# EAGLE design MotorDriver (EAGLE 9.1.3)

## Sheet 1 of 3: Power&Connection
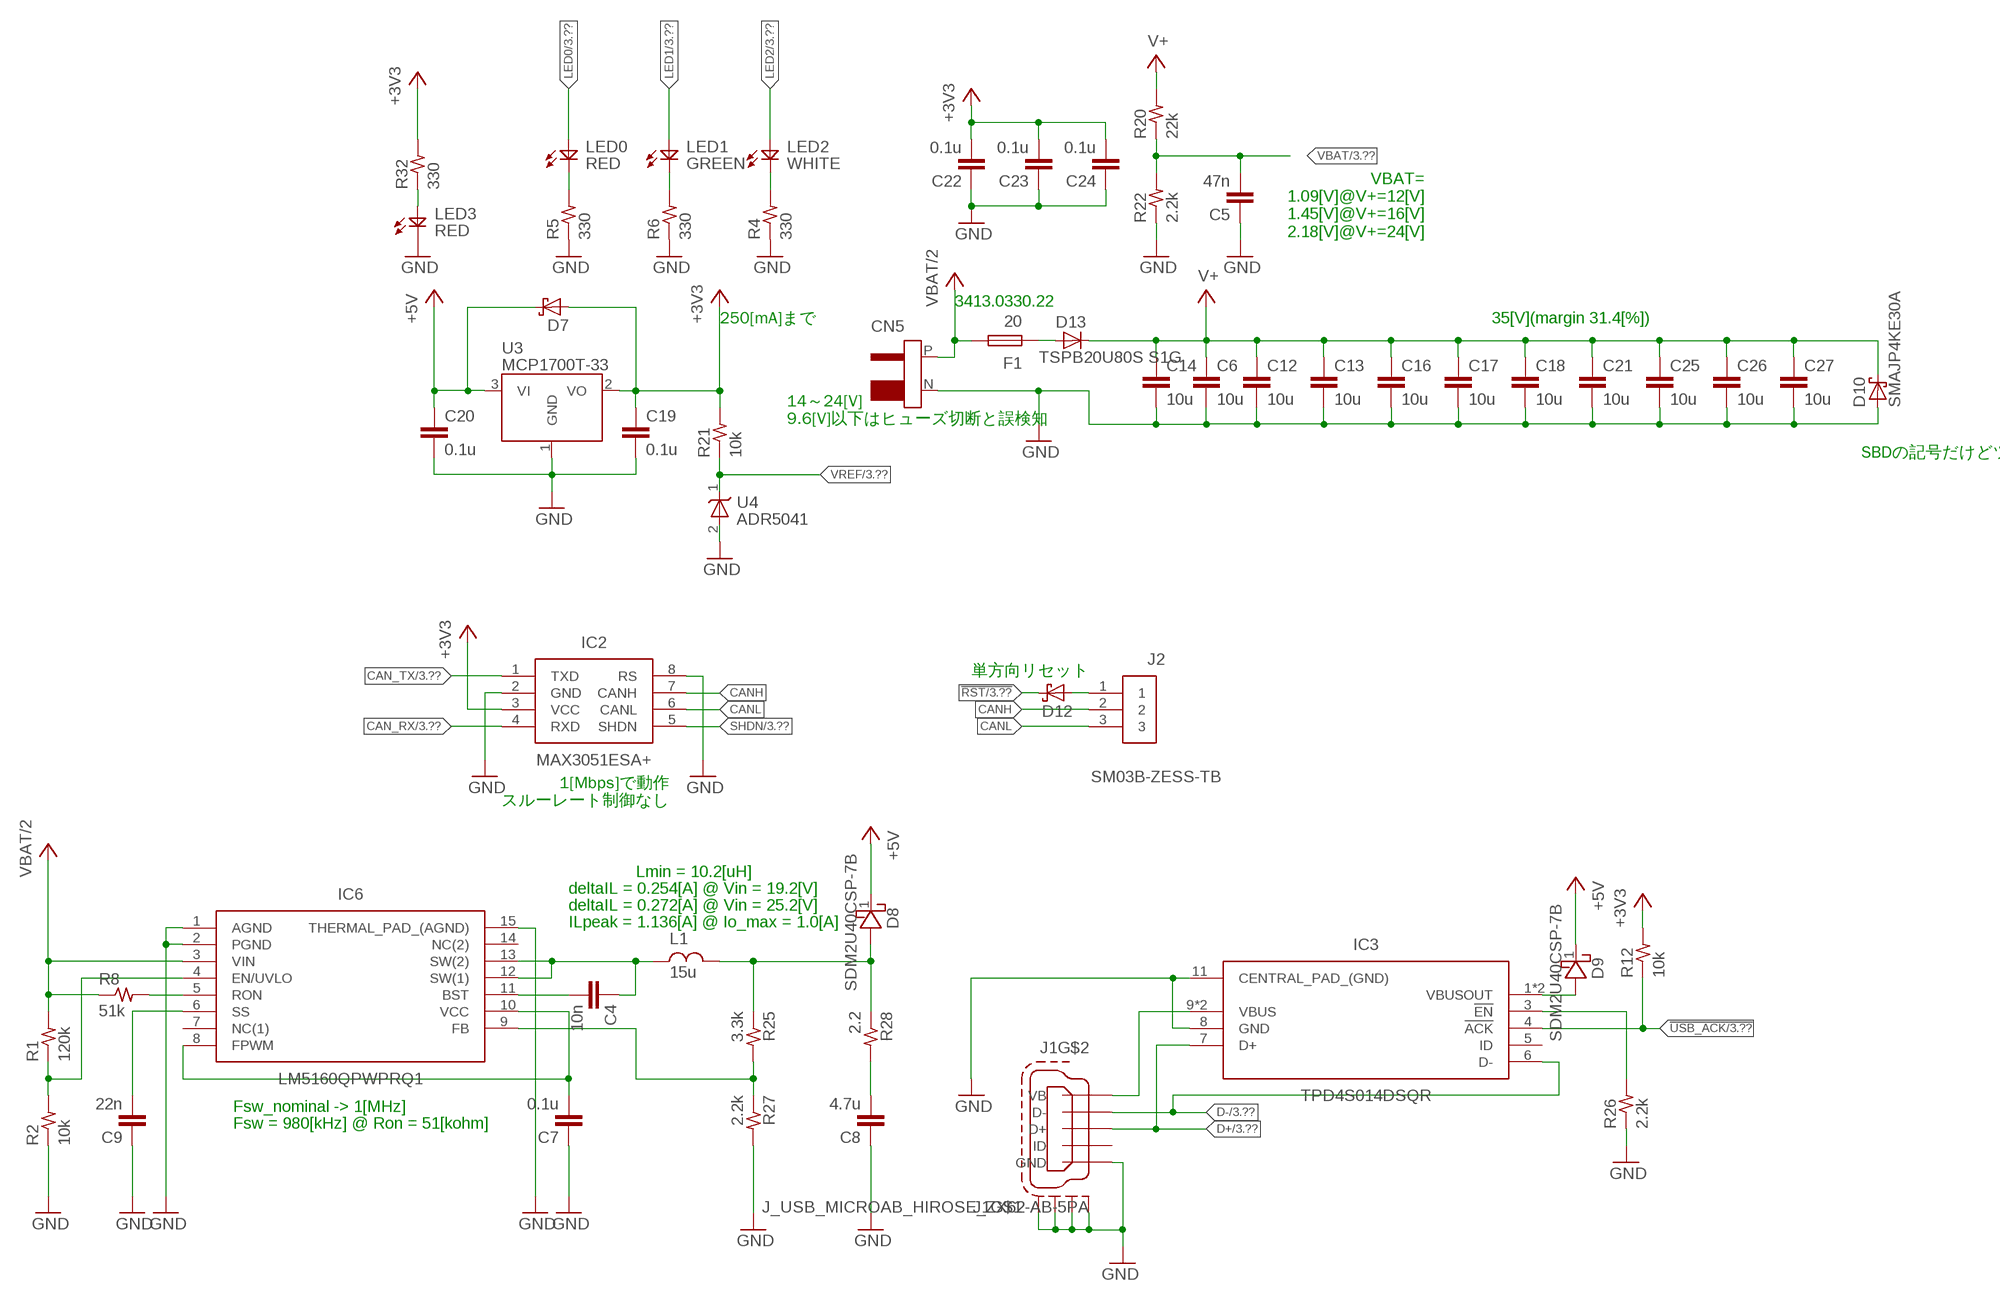
[diagram p0: schematic, sheet 1]

### Parts
C4  10n  C1005  [C1005]
C5  47n  C1005  [C1005]
C6  10u  C3225  [C3225]
C7  0.1u  C1005  [C1005]
C8  4.7u  C1608  [1608]
C9  22n  C1005  [C1005]
C12  10u  C3225  [C3225]
C13  10u  C3225  [C3225]
C14  10u  C3225  [C3225]
C16  10u  C3225  [C3225]
C17  10u  C3225  [C3225]
C18  10u  C3225  [C3225]
C19  0.1u  C1005  [C1005]
C20  0.1u  C1005  [C1005]
C21  10u  C3225  [C3225]
C22  0.1u  C1005  [C1005]
C23  0.1u  C1005  [C1005]
C24  0.1u  C1005  [C1005]
C25  10u  C3225  [C3225]
C26  10u  C3225  [C3225]
C27  10u  C3225  [C3225]
CN5  T-CON  [T-CON]
D7  SBD-SOD523  [DIODE_SOD523]
D8  SDM2U40CSP-7B  [X3-WLB1608-2]
D9  SDM2U40CSP-7B  [X3-WLB1608-2]
D10  SMAJP4KE30A  SBD-DO-214AC  [DO-214AC]
D12  SBD-SOD523  [DIODE_SOD523]
D13  TSPB20U80S S1G  DIODE-SMPC  [SMPC]
F1  20  F3216  [3216]
IC2  MAX3051ESA+  [SOIC127P600X175-8N]
IC3  TPD4S014DSQR  [SON40P200X200X80-11N]
IC6  LM5160QPWPRQ1  [SOP65P640X110-15N]
J1  J_USB_MICROAB_HIROSE_ZX62-AB-5PA  [J_USB_MICROAB_HIROSE_ZX62-AB-5PA]
J2  SM03B-ZESS-TB  [SM03B-ZESS-TB]
L1  15u  L50  [L4949]
LED0  RED  LED1608  [LED1608]
LED1  GREEN  LED1608  [LED1608]
LED2  WHITE  LED1608  [LED1608]
LED3  RED  LED1608  [LED1608]
R1  120k  R1005  [R1005]
R2  10k  R1005  [R1005]
R4  330  R1005  [R1005]
R5  330  R1005  [R1005]
R6  330  R1005  [R1005]
R8  51k  R1005  [R1005]
R12  10k  R1005  [R1005]
R20  22k  R1005  [R1005]
R21  10k  R1005  [R1005]
R22  2.2k  R1005  [R1005]
R25  3.3k  R1005  [R1005]
R26  2.2k  R1005  [R1005]
R27  2.2k  R1005  [R1005]
R28  2.2  R1005  [R1005]
R32  330  R1005  [R1005]
U3  MCP1700T-33  [SOT23-3]
U4  ADR5041  [SC70-3]

### Nets
!RST: D12.K ; also sheet 3
!USB_ACK: IC3.4(!ACK) R12.1 ; also sheet 3
+3V3: C19.1 C22.2 C23.2 C24.2 D7.A IC2.3(VCC) R12.2 R21.2 R32.2 U3.2(VO) ; also sheet 2,3
+5V: C20.1 D7.K D8.1(K) D9.1(K) U3.3(VI) ; also sheet 2
CAN_RX: IC2.4(RXD) ; also sheet 3
CAN_TX: IC2.1(TXD) ; also sheet 3
CANH: IC2.7(CANH) J2.2
CANL: IC2.6(CANL) J2.3
D+: IC3.7(D+) J1.P$3(D+) ; also sheet 3
D-: IC3.6(D-) J1.P$2(D-) ; also sheet 3
GND: C5.1 C6.2 C7.1 C8.1 C9.1 C12.2 C13.2 C14.2 C16.2 C17.2 C18.2 C19.2 C20.2 C21.2 C22.1 C23.1 C24.1 C25.2 C26.2 C27.2 CN5.N D10.A IC2.2(GND) IC2.8(RS) IC3.8(GND) IC3.11(CENTRAL_PAD_(GND)) IC6.1(AGND) IC6.2(PGND) IC6.15(THERMAL_PAD_(AGND)) J1.P$5(GND) J1.SHIELD1(S1) J1.SHIELD2(S2) J1.SHIELD3(S3) J1.SHIELD4(S4) LED3.K R2.1 R4.1 R5.1 R6.1 R22.1 R26.1 R27.2 U3.1(GND) U4.2(A) ; also sheet 2,3
LED0: LED0.A ; also sheet 3
LED1: LED1.A ; also sheet 3
LED2: LED2.A ; also sheet 3
N$1: C7.2 IC6.8(FPWM) IC6.10(VCC)
N$2: IC6.5(RON) R8.2
N$3: IC6.4(EN/UVLO) R1.1 R2.2
N$4: C9.2 IC6.6(SS)
N$8: LED2.K R4.2
N$9: LED0.K R5.2
N$10: LED1.K R6.2
N$14: IC3.9(VBUS) IC3.10(VBUS) J1.P$1(VB)
N$16: C4.1 IC6.12(SW(1)) IC6.13(SW(2)) L1.1
N$17: IC6.9(FB) R25.2 R27.1
N$18: C4.2 IC6.11(BST)
N$19: C8.2 R28.2
N$23: D13.1(A) D13.2(A) F1.1
N$24: D12.A J2.1
N$26: D8.2(A) L1.2 R25.1 R28.1
N$28: IC3.3(!EN) R26.2
N$31: LED3.A R32.1
SHDN: IC2.5(SHDN) ; also sheet 3
V+: C6.1 C12.1 C13.1 C14.1 C16.1 C17.1 C18.1 C21.1 C25.1 C26.1 C27.1 D10.K D13.K R20.2 ; also sheet 2
VBAT: C5.2 R20.1 R22.2 ; also sheet 3
VBAT/2: CN5.P F1.2 IC6.3(VIN) R1.2 R8.1
VBUS: D9.2(A) IC3.1(VBUSOUT) IC3.2(VBUSOUT)
VREF: R21.1 U4.1(K) ; also sheet 3
Unconnected: IC3.5(ID) IC6.7(NC(1)) IC6.14(NC(2)) J1.P$4(ID)

### Notes on the sheet
- VBAT=
    1.09[V]@V+=12[V]
    1.45[V]@V+=16[V]
    2.18[V]@V+=24[V]
- 3413.0330.22
- 250[mA]まで | 35[V](margin 31.4[%])
- 14～24[V]
  9.6[V]以下はヒューズ切断と誤検知
- SBDの記号だけどツェナー
- 単方向リセット
- 1[Mbps]で動作
  スルーレート制御なし
- Lmin = 10.2[uH]
- deltaIL = 0.254[A] @ Vin = 19.2[V]
- deltaIL = 0.272[A] @ Vin = 25.2[V]
- ILpeak = 1.136[A] @ Io_max = 1.0[A]
- Fsw_nominal -> 1[MHz]
- Fsw = 980[kHz] @ Ron = 51[kohm]

## Sheet 2 of 3: Motor
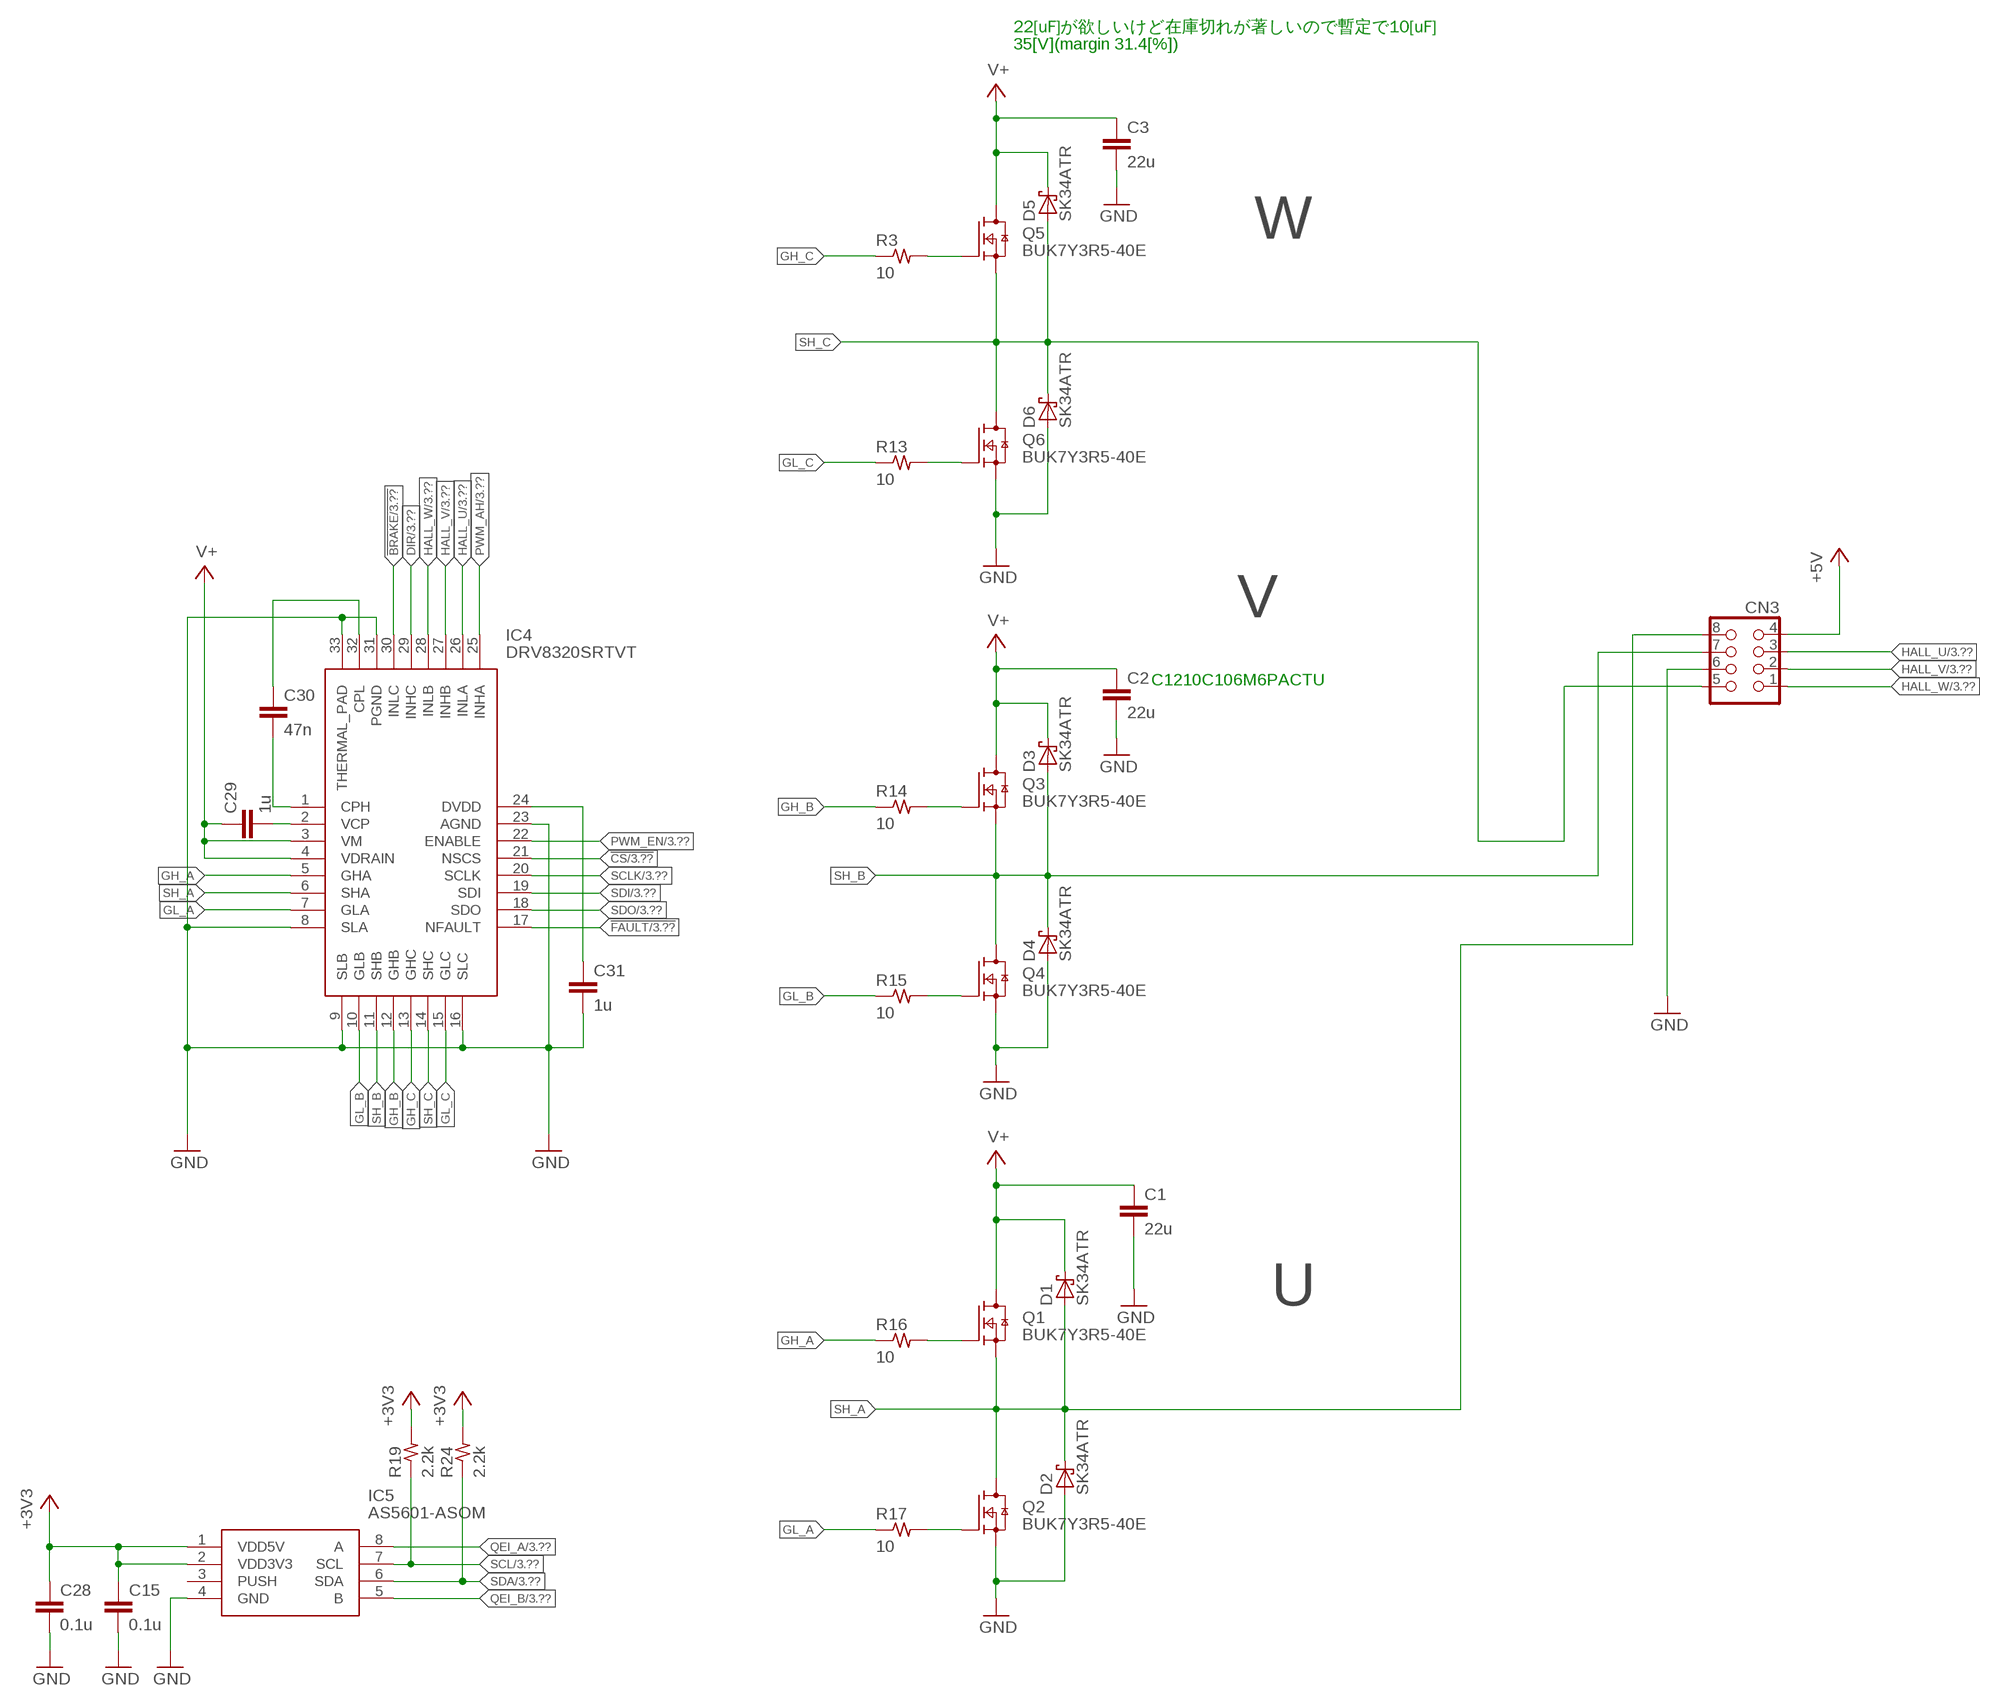
[diagram p1: schematic, sheet 2]

### Parts
C1  22u  C3225  [C3225]
C2  22u  C3225  [C3225]
C3  22u  C3225  [C3225]
C15  0.1u  C1005  [C1005]
C28  0.1u  C1005  [C1005]
C29  1u  C1005  [C1005]
C30  47n  C1005  [C1005]
C31  1u  C1005  [C1005]
CN3  43045-0800  [43045-0800]
D1  SK34ATR  SBD-DO-214AC  [DO-214AC]
D2  SK34ATR  SBD-DO-214AC  [DO-214AC]
D3  SK34ATR  SBD-DO-214AC  [DO-214AC]
D4  SK34ATR  SBD-DO-214AC  [DO-214AC]
D5  SK34ATR  SBD-DO-214AC  [DO-214AC]
D6  SK34ATR  SBD-DO-214AC  [DO-214AC]
IC4  DRV8320SRTVT  [QFN50P500X500X80-33N]
IC5  AS5601-ASOM  [SOIC127P600X175-8N]
Q1  BUK7Y3R5-40E  [SOT669]
Q2  BUK7Y3R5-40E  [SOT669]
Q3  BUK7Y3R5-40E  [SOT669]
Q4  BUK7Y3R5-40E  [SOT669]
Q5  BUK7Y3R5-40E  [SOT669]
Q6  BUK7Y3R5-40E  [SOT669]
R3  10  R1608  [R1608]
R13  10  R1608  [R1608]
R14  10  R1608  [R1608]
R15  10  R1608  [R1608]
R16  10  R1608  [R1608]
R17  10  R1608  [R1608]
R19  2.2k  R1005  [R1005]
R24  2.2k  R1005  [R1005]

### Nets
!BRAKE: IC4.30(INLC) ; also sheet 3
!CS: IC4.21(NSCS) ; also sheet 3
!FAULT: IC4.17(NFAULT) ; also sheet 3
+3V3: C15.1 C28.1 IC5.1(VDD5V) IC5.2(VDD3V3) R19.2 R24.2 ; also sheet 1,3
+5V: CN3.4 ; also sheet 1
DIR: IC4.29(INHC) ; also sheet 3
GH_A: IC4.5(GHA) R16.1
GH_B: IC4.12(GHB) R14.1
GH_C: IC4.13(GHC) R3.1
GL_A: IC4.7(GLA) R17.1
GL_B: IC4.10(GLB) R15.1
GL_C: IC4.15(GLC) R13.1
GND: C1.2 C2.2 C3.2 C15.2 C28.2 C31.2 CN3.6 D2.A D4.A D6.A IC4.8(SLA) IC4.9(SLB) IC4.16(SLC) IC4.23(AGND) IC4.31(PGND) IC4.33(THERMAL_PAD) IC5.4(GND) Q2.1(S) Q2.2(S) Q2.3(S) Q4.1(S) Q4.2(S) Q4.3(S) Q6.1(S) Q6.2(S) Q6.3(S) ; also sheet 1,3
HALL_U: CN3.3 IC4.26(INLA) ; also sheet 3
HALL_V: CN3.2 IC4.27(INHB) ; also sheet 3
HALL_W: CN3.1 IC4.28(INLB) ; also sheet 3
N$5: Q2.4(G) R17.2
N$6: Q1.4(G) R16.2
N$7: Q4.4(G) R15.2
N$11: Q3.4(G) R14.2
N$12: Q6.4(G) R13.2
N$13: Q5.4(G) R3.2
N$32: C31.1 IC4.24(DVDD)
N$48: C30.1 IC4.32(CPL)
N$55: C29.2 IC4.2(VCP)
N$56: C30.2 IC4.1(CPH)
PWM_AH: IC4.25(INHA) ; also sheet 3
PWM_EN: IC4.22(ENABLE) ; also sheet 3
QEI_A: IC5.8(A) ; also sheet 3
QEI_B: IC5.5(B) ; also sheet 3
SCL: IC5.7(SCL) R19.1 ; also sheet 3
SCLK: IC4.20(SCLK) ; also sheet 3
SDA: IC5.6(SDA) R24.1 ; also sheet 3
SDI: IC4.19(SDI) ; also sheet 3
SDO: IC4.18(SDO) ; also sheet 3
SH_A: CN3.8 D1.A D2.K IC4.6(SHA) Q1.1(S) Q1.2(S) Q1.3(S) Q2.MB(D)
SH_B: CN3.7 D3.A D4.K IC4.11(SHB) Q3.1(S) Q3.2(S) Q3.3(S) Q4.MB(D)
SH_C: CN3.5 D5.A D6.K IC4.14(SHC) Q5.1(S) Q5.2(S) Q5.3(S) Q6.MB(D)
V+: C1.1 C2.1 C3.1 C29.1 D1.K D3.K D5.K IC4.3(VM) IC4.4(VDRAIN) Q1.MB(D) Q3.MB(D) Q5.MB(D) ; also sheet 1
Unconnected: IC5.3(PUSH)

### Notes on the sheet
- 22[uF]が欲しいけど在庫切れが著しいので暫定で10[uF]
- 35[V](margin 31.4[%])
- W
- V
- C1210C106M6PACTU
- U

## Sheet 3 of 3: MCU
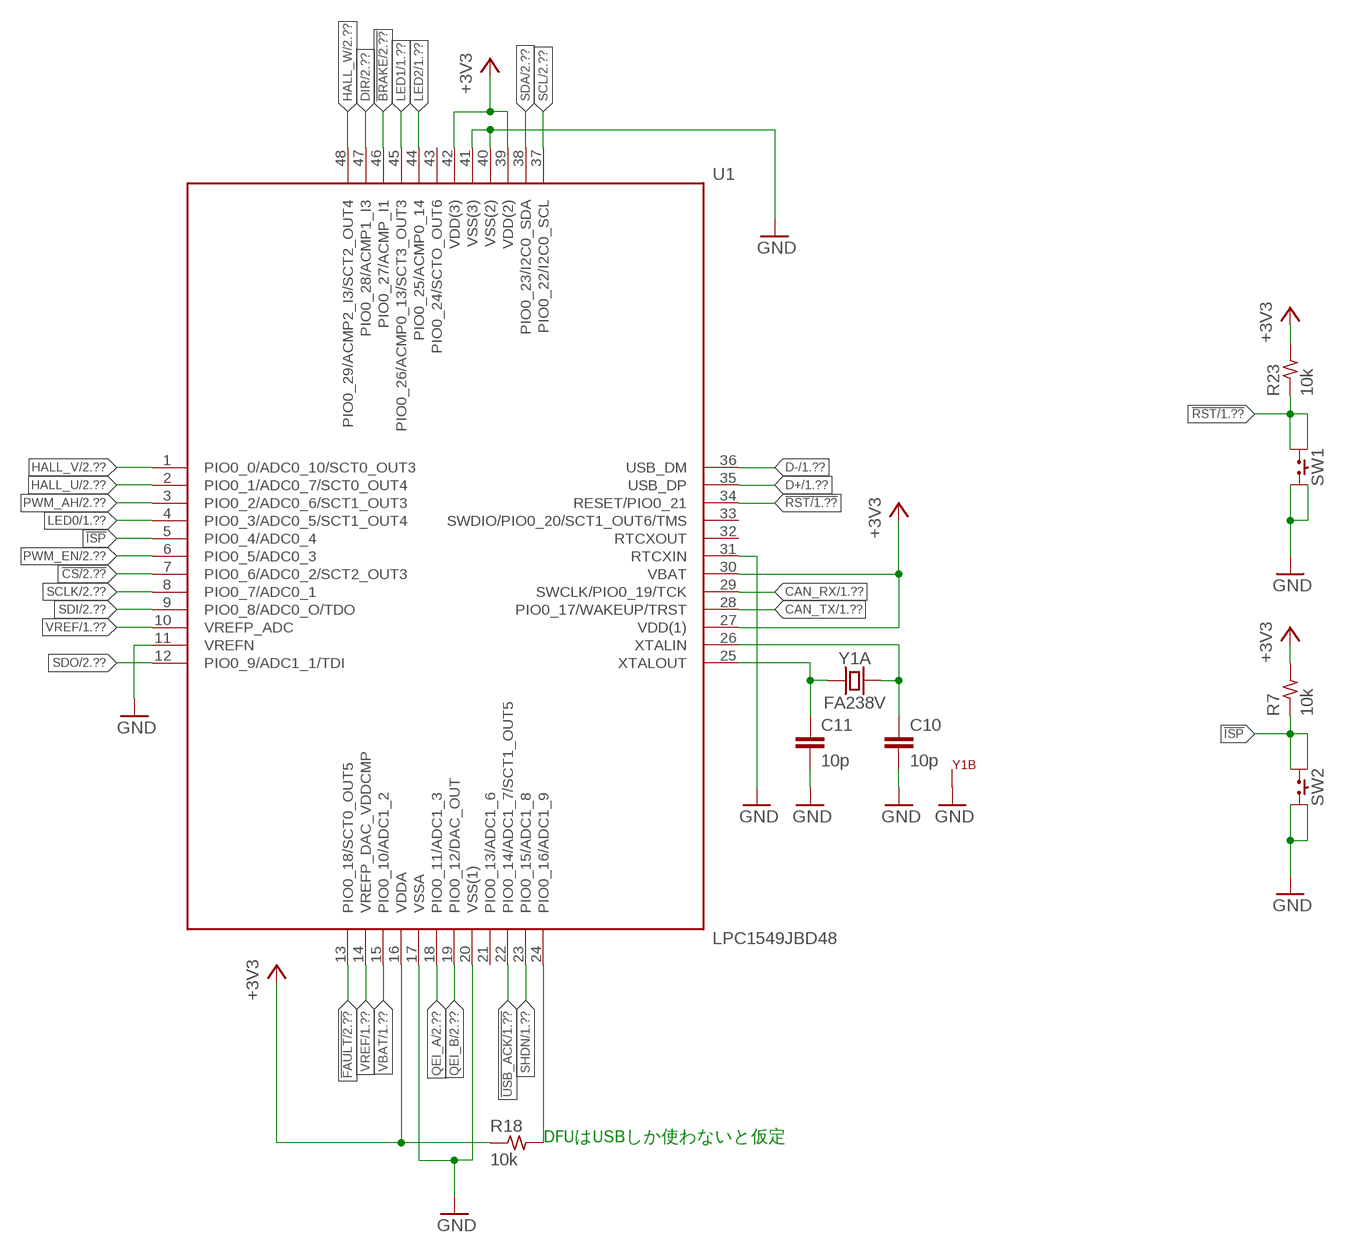
[diagram p2: schematic, sheet 3]

### Parts
C10  10p  C1005  [C1005]
C11  10p  C1005  [C1005]
R7  10k  R1005  [R1005]
R18  10k  R1005  [R1005]
R23  10k  R1005  [R1005]
SW1  SKRP  [SKRP]
SW2  SKRP  [SKRP]
U1  LPC1549JBD48  [QFP48]
Y1  FA238V  [EPSON_FA238V]

### Nets
!BRAKE: U1.46(PIO0_27/ACMP_I1) ; also sheet 2
!CS: U1.7(PIO0_6/ADC0_2/SCT2_OUT3) ; also sheet 2
!FAULT: U1.13(PIO0_18/SCT0_OUT5) ; also sheet 2
!ISP: R7.1 SW2.A1 SW2.A2 U1.5(PIO0_4/ADC0_4)
!RST: R23.1 SW1.A1 SW1.A2 U1.34(RESET/PIO0_21) ; also sheet 1
!USB_ACK: U1.22(PIO0_14/ADC1_7/SCT1_OUT5) ; also sheet 1
+3V3: R7.2 R18.1 R23.2 U1.16(VDDA) U1.27(VDD(1)) U1.30(VBAT) U1.39(VDD(2)) U1.42(VDD(3)) ; also sheet 1,2
CAN_RX: U1.29(SWCLK/PIO0_19/TCK) ; also sheet 1
CAN_TX: U1.28(PIO0_17/WAKEUP/TRST) ; also sheet 1
D+: U1.35(USB_DP) ; also sheet 1
D-: U1.36(USB_DM) ; also sheet 1
DIR: U1.47(PIO0_28/ACMP1_I3) ; also sheet 2
GND: C10.2 C11.2 SW1.B1 SW1.B2 SW2.B1 SW2.B2 U1.11(VREFN) U1.17(VSSA) U1.20(VSS(1)) U1.31(RTCXIN) U1.40(VSS(2)) U1.41(VSS(3)) Y1.2 Y1.4 ; also sheet 1,2
HALL_U: U1.2(PIO0_1/ADC0_7/SCT0_OUT4) ; also sheet 2
HALL_V: U1.1(PIO0_0/ADC0_10/SCT0_OUT3) ; also sheet 2
HALL_W: U1.48(PIO0_29/ACMP2_I3/SCT2_OUT4) ; also sheet 2
LED0: U1.4(PIO0_3/ADC0_5/SCT1_OUT4) ; also sheet 1
LED1: U1.45(PIO0_26/ACMP0_13/SCT3_OUT3) ; also sheet 1
LED2: U1.44(PIO0_25/ACMP0_14) ; also sheet 1
N$15: R18.2 U1.24(PIO0_16/ADC1_9)
N$21: C11.1 U1.25(XTALOUT) Y1.1
N$22: C10.1 U1.26(XTALIN) Y1.3
PWM_AH: U1.3(PIO0_2/ADC0_6/SCT1_OUT3) ; also sheet 2
PWM_EN: U1.6(PIO0_5/ADC0_3) ; also sheet 2
QEI_A: U1.18(PIO0_11/ADC1_3) ; also sheet 2
QEI_B: U1.19(PIO0_12/DAC_OUT) ; also sheet 2
SCL: U1.37(PIO0_22/I2C0_SCL) ; also sheet 2
SCLK: U1.8(PIO0_7/ADC0_1) ; also sheet 2
SDA: U1.38(PIO0_23/I2C0_SDA) ; also sheet 2
SDI: U1.9(PIO0_8/ADC0_O/TDO) ; also sheet 2
SDO: U1.12(PIO0_9/ADC1_1/TDI) ; also sheet 2
SHDN: U1.23(PIO0_15/ADC1_8) ; also sheet 1
VBAT: U1.15(PIO0_10/ADC1_2) ; also sheet 1
VREF: U1.10(VREFP_ADC) U1.14(VREFP_DAC_VDDCMP) ; also sheet 1
Unconnected: U1.21(PIO0_13/ADC1_6) U1.32(RTCXOUT) U1.33(SWDIO/PIO0_20/SCT1_OUT6/TMS) U1.43(PIO0_24/SCTO_OUT6)

### Notes on the sheet
- DFUはUSBしか使わないと仮定

## Library data of the parts
C1-C7 C9-C31 = MotorDriver:C
C8 = Passive:C
CN3 = MotorDriver:43045-0800
CN5 = Connector:T-CON
D1-D7 D10 D12 = MotorDriver:SBD-*
D8 D9 = SDM2U40CSP-7B:SDM2U40CSP-7B: 2A SCHOTTKY BARRIER RECTIFIER CHIP SCALE PACKAGE Source: Datasheet <https://www.diodes.com/assets/Datasheets/SDM2U40CSP.pdf>; DESCRIPTION: 2A SCHOTTKY BARRIER RECTIFIER CHIP SCALE PACKAGE; HEIGHT: mm; MANUFACTURER_NAME: Diodes Inc.; MANUFACTURER_PART_NUMBER: SDM2U40CSP-7B; SUPPLIER_NAME: RS
D13 = diode:DIODE-*
F1 = Passive:F
IC2 = MAX3051ESA+:MAX3051ESA+: CAN Transceiver 1 Mbit/s ISO 11898 Standby-Mode 8pins SOIC <https://componentsearchengine.com/Images/3/MAX3051ESA%2B.jpg> Source: Datasheet <http://datasheets.maximintegrated.com/en/ds/MAX3051.pdf>; DESCRIPTION: CAN Transceiver 1 Mbit/s ISO 11898 Standby-Mode 8pins SOIC; HEIGHT: 1.75mm; MANUFACTURER_NAME: Maxim Integrated; MANUFACTURER_PART_NUMBER: MAX3051ESA+; RS_PART_NUMBER: 7329005; SUPPLIER_NAME: RS
IC3 = TPD4S014DSQR:TPD4S014DSQR: Texas Instruments TPD4S014DSQR, USB Controller, 480Mbit/s, USB 2.0, 10-Pin SON <https://componentsearchengine.com/Images/3/TPD4S014DSQR.jpg> Source: Datasheet <http://www.ti.com/lit/gpn/tpd4s014>; DESCRIPTION: Texas Instruments TPD4S014DSQR, USB Controller, 480Mbit/s, USB 2.0, 10-Pin SON; HEIGHT: 0.8mm; MANUFACTURER_NAME: Texas Instruments; MANUFACTURER_PART_NUMBER: TPD4S014DSQR; RS_PART_NUMBER: 7422968; SUPPLIER_NAME: RS
IC4 = DRV8320SRTVT:DRV8320SRTVT: TEXAS INSTRUMENTS - DRV8320SRTVT - MOSFET DRIVER, HALF BRIDGE, WQFN-32 Source: Datasheet <http://www.ti.com/general/docs/lit/getliterature.tsp?genericPartNumber=DRV8320&fileType=pdf>; DESCRIPTION: TEXAS INSTRUMENTS - DRV8320SRTVT - MOSFET DRIVER, HALF BRIDGE, WQFN-32; HEIGHT: 0.8mm; MANUFACTURER_NAME: Texas Instruments; MANUFACTURER_PART_NUMBER: DRV8320SRTVT
IC5 = AS5601-ASOM:AS5601-ASOM: Board Mount Hall Effect / Magnetic Sensors 12-Bit Rotary Sensor Incr Quad 8 to 2048 Source: Datasheet <http://uk.rs-online.com/web/p/products/1700757>; DESCRIPTION: Board Mount Hall Effect / Magnetic Sensors 12-Bit Rotary Sensor Incr Quad 8 to 2048; HEIGHT: 1.75mm; MANUFACTURER_NAME: ams; MANUFACTURER_PART_NUMBER: AS5601-ASOM; RS_PART_NUMBER: 1700757
IC6 = LM5160QPWPRQ1:LM5160QPWPRQ1: Voltage Regulators - Switching Regulators Wide Input 65V, 1.5A Synchronous Buck / Fly-Buck? Converter 14-HTSSOP -40 to 125 <https://componentsearchengine.com/Images/1/LM5160QPWPRQ1.jpg> Source: Datasheet <http://www.ti.com/lit/gpn/lm5160-q1>; DESCRIPTION: Voltage Regulators - Switching Regulators Wide Input 65V, 1.5A Synchronous Buck / Fly-Buck? Converter 14-HTSSOP -40 to 125; HEIGHT: 1.1mm; MANUFACTURER_NAME: Texas Instruments; MANUFACTURER_PART_NUMBER: LM5160QPWPRQ1; SUPPLIER_NAME: RS
J1 = j_usb_hirose_zx62-ab-5pa:J_USB_MICROAB_HIROSE_ZX62-AB-5PA: USB Micro-AB SMT connector Hirose Electric Co Ltd: ZX62-AB-5P
J2 = SM03B-ZESS-TB:SM03B-ZESS-TB: JST (JAPAN SOLDERLESS TERMINALS) - SM03B-ZESS-TB - HEADER, ZE, SIDE, SMT, 3WAY Source: Datasheet <http://www.jst-mfg.com/product/pdf/eng/eZE.pdf>; DESCRIPTION: JST (JAPAN SOLDERLESS TERMINALS) - SM03B-ZESS-TB - HEADER, ZE, SIDE, SMT, 3WAY; HEIGHT: mm; MANUFACTURER_NAME: JST (JAPAN SOLDERLESS TERMINALS); MANUFACTURER_PART_NUMBER: SM03B-ZESS-TB; SUPPLIER_NAME: RS
L1 = Passive:L
LED0 LED1-LED3 = MotorDriver:LED
Q1-Q6 = NXP_60_26022015:BUK7Y3R5-40E: N-channel 40 V, 3.5 mΩ standard level MOSFET in LFPAK56 Standard level N-channel MOSFET in an LFPAK56 (Power SO8) package using TrenchMOS technology. This product has been designed and qualified to AEC Q101 standard for use in high performance automotive applications. AAL Eindhoven MK
R1-R8 R12-R28 R32 = MotorDriver:R
SW1 SW2 = MotorDriver:SKRP
U1 = MotorDriver:LPC1549JBD48: NXP - LPC1549JBD48 - 32BIT MCU, CORTEX-M3, 72 MHZ, LQFP-48 Source: Datasheet <http://www.farnell.com/datasheets/1963077.pdf>; DESCRIPTION: NXP - LPC1549JBD48 - 32BIT MCU, CORTEX-M3, 72 MHZ, LQFP-48; HEIGHT: 1.6mm; MANUFACTURER_NAME: NXP; MANUFACTURER_PART_NUMBER: LPC1549JBD48; SUPPLIER_NAME: RS
U3 = MotorDriver:MCP1700T-*
U4 = MotorDriver:ADR504*
Y1 = FA238V:FA238V: MHz RANGE CRYSTAL UNIT Source: Datasheet <https://support.epson.biz/td/api/doc_check.php?mode=dl&lang=en&Parts=FA-238V>; DESCRIPTION: MHz RANGE CRYSTAL UNIT; HEIGHT: mm; MANUFACTURER_NAME: Epson ICs; MANUFACTURER_PART_NUMBER: FA238V; SUPPLIER_NAME: RS

## Board
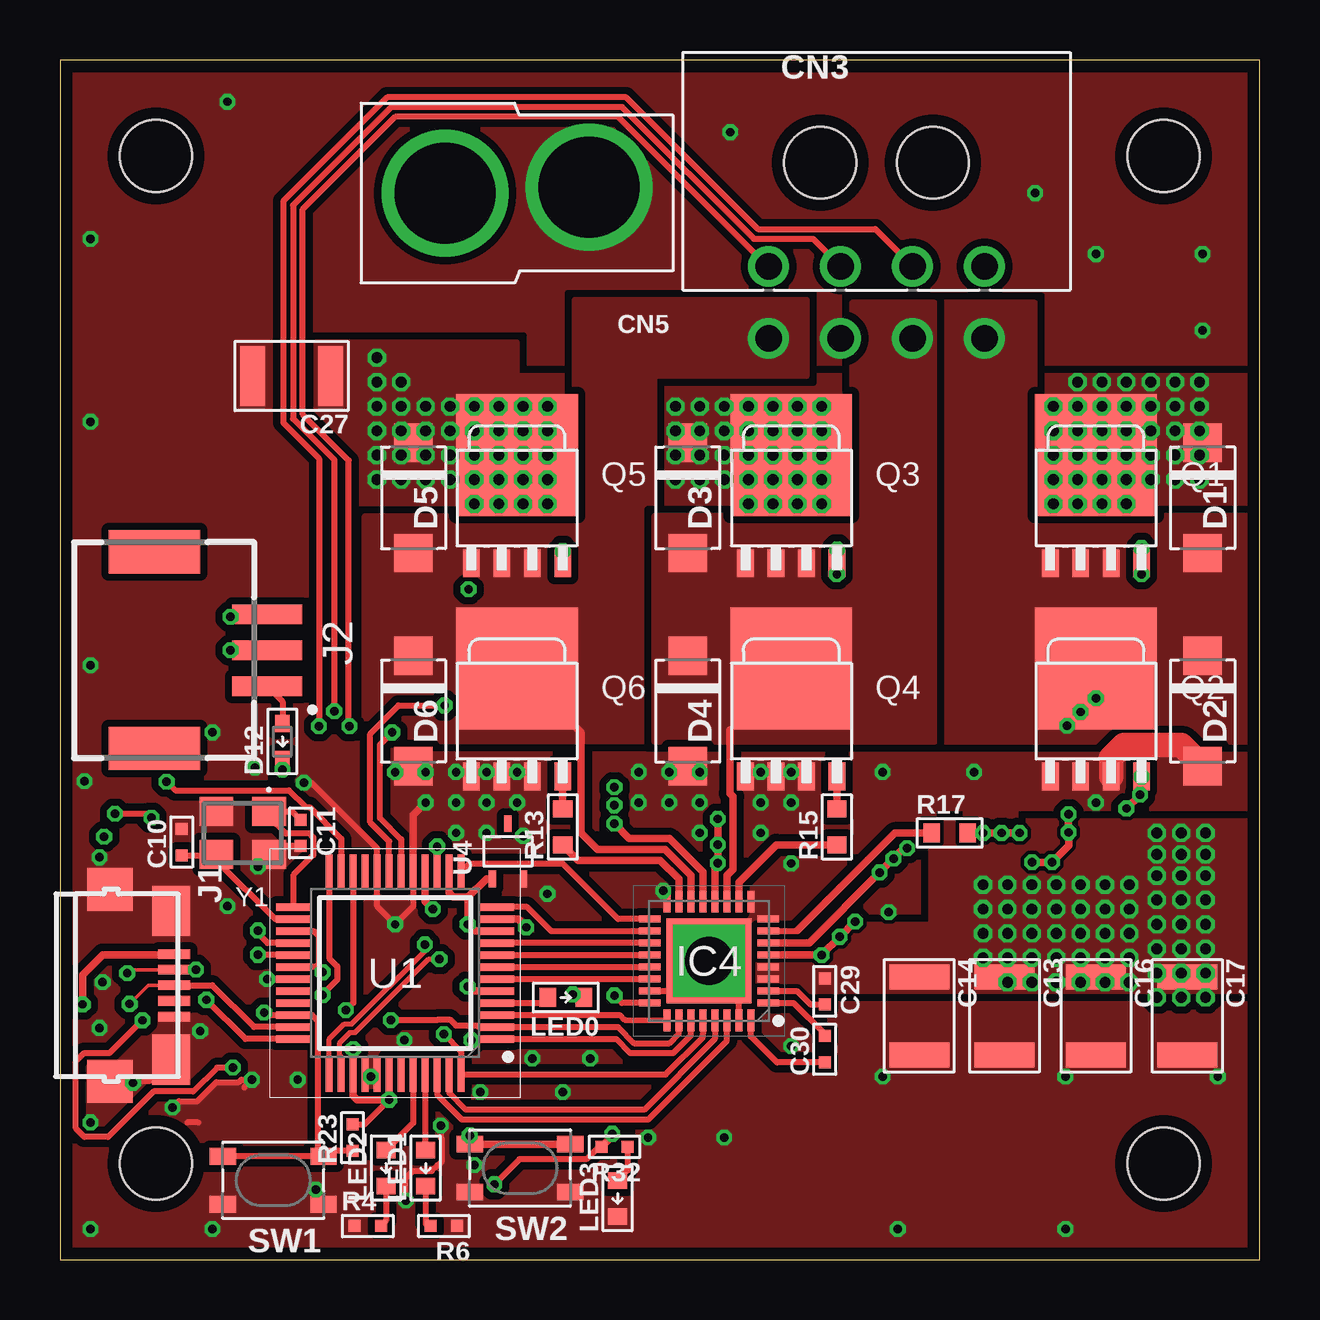
[diagram p3: board, top side]
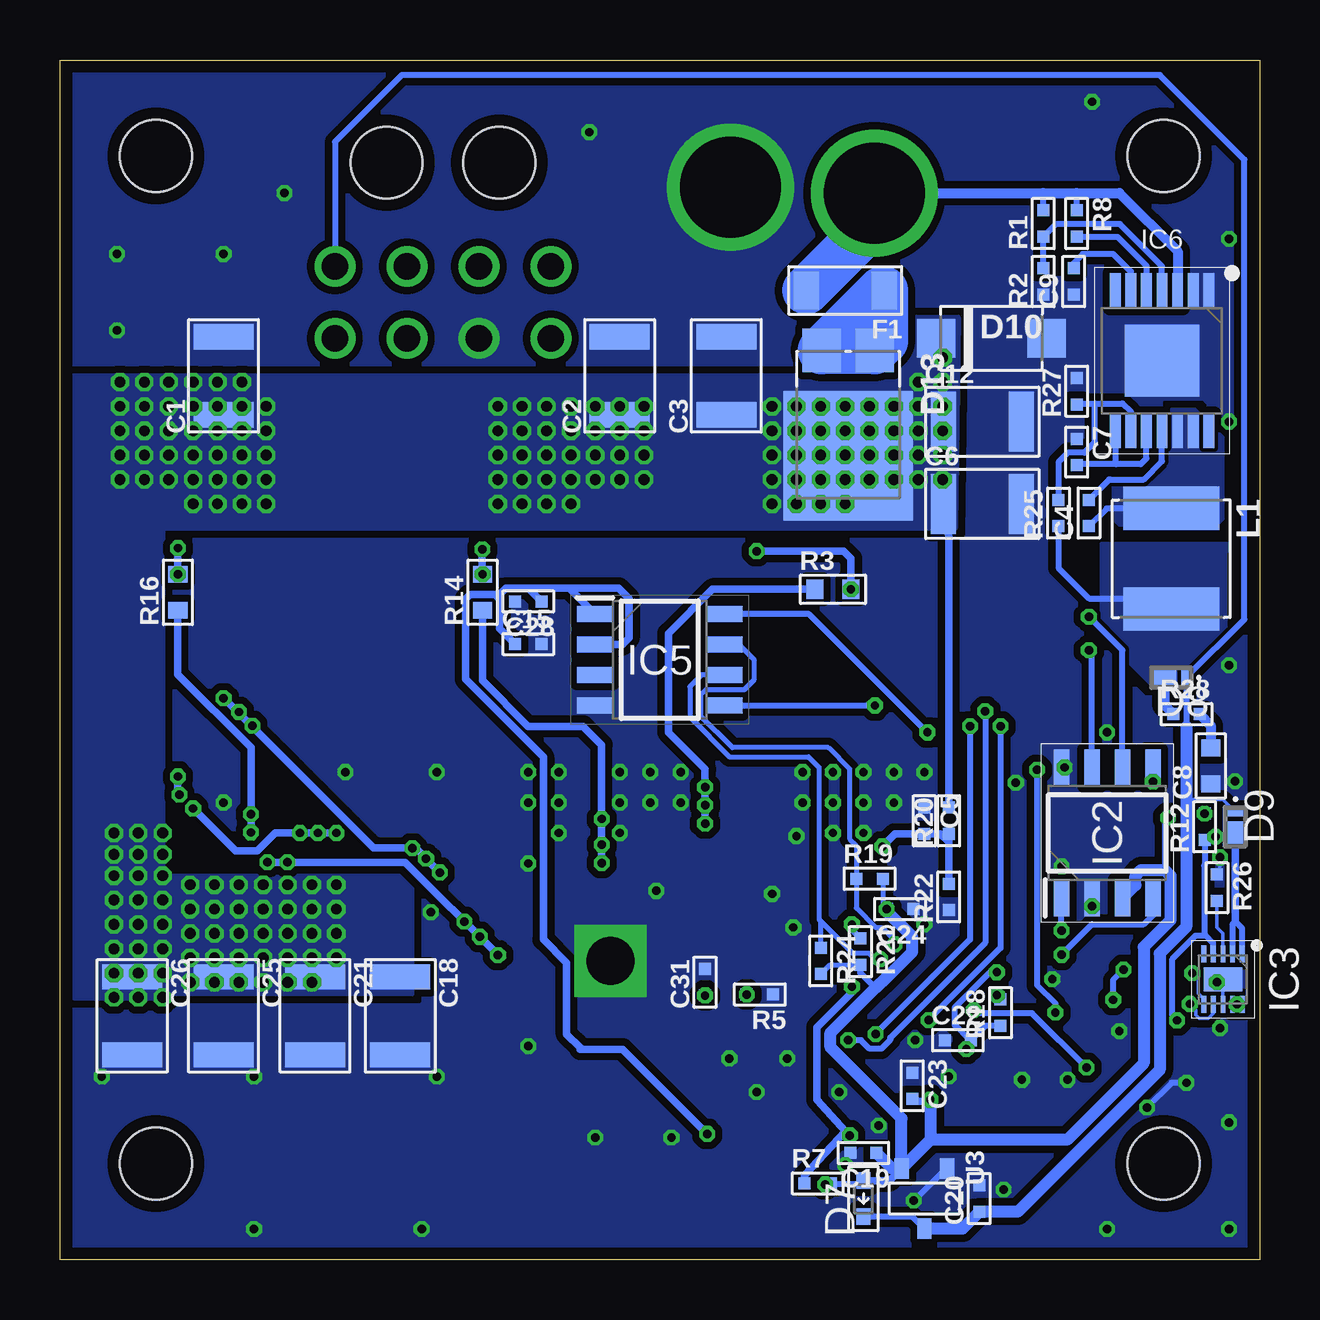
[diagram p4: board, bottom side, seen from below]

Size 50 x 50 mm. Coordinates in mm from the lower left corner, seen from the top.
Outline: 0,0 50,0 50,50 0,50 0,0
Copper layers (1*16): Top 0.035mm / dielectric 1.6mm / Bottom 0.035mm
Design rules "Elecrow_2-layer_PCB_eagle_rule": minimum track width 6mil, minimum drill 12mil, track to track 6mil, track to pad 6mil, pad to pad 6mil, via to via 8mil, smd to smd 0mil, copper to edge 20mil, drill to drill 10mil, minimum pad ring 6mil, minimum via ring 6mil, stop-mask expansion 0mil, vias tented up to drill 100mil, thermal gap 10mil
Holes 3 mm at 4,46 46,46 4,4 46,4

### Footprints (pad centres in the part's own frame; a part is rotated, then mirrored left to right if it is on the bottom)
C3225 = smd 1.05 x 2.5: 1 -1.625,0; 2 1.625,0
C1005 = smd 0.5 x 0.5: 1 -0.55,0; 2 0.55,0
1608 = smd 0.7 x 0.8: 1 -0.75,0; 2 0.75,0
43045-0800 = drill 1.1 pad 1.7: 1 -4.5,-4.32; 2 -1.5,-4.32; 3 1.5,-4.32; 4 4.5,-4.32; 5 -4.5,-7.32; 6 -1.5,-7.32; 7 1.5,-7.32; 8 4.5,-7.32 | hole 3: 2.35,0; -2.35,0
T-CON = drill 4.2 pad 5.3: N -3,-0.25; P 3,0
DO-214AC = smd 1.6 x 1.6: A 2.3,0; K -2.3,0
DIODE_SOD523 = smd 0.7 x 0.6: A 0.75,0; K -0.75,0
X3-WLB1608-2 = smd 0.385 x 0.69: 1 -0.619,0 | smd 1.035 x 0.69: 2 0.293,0
SMPC = smd 1.6 x 1.8: 1 1.1,-3.1; 2 -1.1,-3.1 | smd 5.4 x 5.4: K 0,1.3
3216 = smd 1.05 x 1.6: 1 -1.625,0; 2 1.625,0
SOIC127P600X175-8N = smd 1.525 x 0.65: 1 -2.712,1.905; 2 -2.712,0.635; 3 -2.712,-0.635; 4 -2.712,-1.905; 5 2.712,-1.905; 6 2.712,-0.635; 7 2.712,0.635; 8 2.712,1.905
SON40P200X200X80-11N = smd 0.7 x 0.2: 1 -1.05,0.8; 2 -1.05,0.4; 3 -1.05,0; 4 -1.05,-0.4; 5 -1.05,-0.8; 6 1.05,-0.8; 7 1.05,-0.4; 8 1.05,0; 9 1.05,0.4; 10 1.05,0.8 | smd 1 x 1.6: 11 0,0
QFN50P500X500X80-33N = smd 0.9 x 0.3: 1 -2.475,1.75; 2 -2.475,1.25; 3 -2.475,0.75; 4 -2.475,0.25; 5 -2.475,-0.25; 6 -2.475,-0.75; 7 -2.475,-1.25; 8 -2.475,-1.75; 17 2.475,-1.75; 18 2.475,-1.25; 19 2.475,-0.75; 20 2.475,-0.25; 21 2.475,0.25; 22 2.475,0.75; 23 2.475,1.25; 24 2.475,1.75 | smd 0.3 x 0.9: 9 -1.75,-2.475; 10 -1.25,-2.475; 11 -0.75,-2.475; 12 -0.25,-2.475; 13 0.25,-2.475; 14 0.75,-2.475; 15 1.25,-2.475; 16 1.75,-2.475; 25 1.75,2.475; 26 1.25,2.475; 27 0.75,2.475; 28 0.25,2.475; 29 -0.25,2.475; 30 -0.75,2.475; 31 -1.25,2.475; 32 -1.75,2.475 | smd 3.55 x 3.55: 33 0,0
SOIC127P600X175-8N' = smd 1.5 x 0.65: 1 -2.7,1.905; 2 -2.7,0.635; 3 -2.7,-0.635; 4 -2.7,-1.905; 5 2.7,-1.905; 6 2.7,-0.635; 7 2.7,0.635; 8 2.7,1.905
SOP65P640X110-15N = smd 1.45 x 0.45: 1 -2.925,1.95; 2 -2.925,1.3; 3 -2.925,0.65; 4 -2.925,0; 5 -2.925,-0.65; 6 -2.925,-1.3; 7 -2.925,-1.95; 8 2.925,-1.95; 9 2.925,-1.3; 10 2.925,-0.65; 11 2.925,0; 12 2.925,0.65; 13 2.925,1.3; 14 2.925,1.95 | smd 3 x 3.1: 15 0,0
J_USB_MICROAB_HIROSE_ZX62-AB-5PA = smd 0.4 x 1.35: P$1 -1.3,4.125; P$2 -0.65,4.125; P$3 0,4.125; P$4 0.65,4.125; P$5 1.3,4.125 | smd 1.8 x 1.9: SHIELD1 -4,1.45; SHIELD4 4,1.45 | smd 2.1 x 1.6: SHIELD2 -3.1,4; SHIELD3 3.1,4
SM03B-ZESS-TB = smd 0.8 x 2.9: 1 1.5,0; 2 0,0; 3 -1.5,0 | smd 1.8 x 3.8: 4 -4.1,-4.7; 5 4.1,-4.7
L4949 = smd 1.8 x 4: 1 -2.1,0; 2 2.1,0
LED1608 = smd 0.7 x 0.8: A 0.75,0; K -0.75,0
SOT669 = smd 0.7 x 1.15: 1 -1.905,-2.725; 2 -0.636,-2.725; 3 0.635,-2.725; 4 1.905,-2.725 | smd 5.08 x 5.08: MB 0,1.778
R1005 = smd 0.5 x 0.5: 1 -0.55,0; 2 0.55,0
R1608 = smd 0.7 x 0.8: 1 -0.75,0; 2 0.75,0
SKRP = smd 1.1 x 0.7: A1 -2.1,-1; A2 2.1,-1; B1 -2.1,1; B2 2.1,1
QFP48 = smd 1.45 x 0.3: 1 -4.225,2.75; 2 -4.225,2.25; 3 -4.225,1.75; 4 -4.225,1.25; 5 -4.225,0.75; 6 -4.225,0.25; 7 -4.225,-0.25; 8 -4.225,-0.75; 9 -4.225,-1.25; 10 -4.225,-1.75; 11 -4.225,-2.25; 12 -4.225,-2.75; 25 4.225,-2.75; 26 4.225,-2.25; 27 4.225,-1.75; 28 4.225,-1.25; 29 4.225,-0.75; 30 4.225,-0.25; 31 4.225,0.25; 32 4.225,0.75; 33 4.225,1.25; 34 4.225,1.75; 35 4.225,2.25; 36 4.225,2.75 | smd 0.3 x 1.45: 13 -2.75,-4.225; 14 -2.25,-4.225; 15 -1.75,-4.225; 16 -1.25,-4.225; 17 -0.75,-4.225; 18 -0.25,-4.225; 19 0.25,-4.225; 20 0.75,-4.225; 21 1.25,-4.225; 22 1.75,-4.225; 23 2.25,-4.225; 24 2.75,-4.225; 37 2.75,4.225; 38 2.25,4.225; 39 1.75,4.225; 40 1.25,4.225; 41 0.75,4.225; 42 0.25,4.225; 43 -0.25,4.225; 44 -0.75,4.225; 45 -1.25,4.225; 46 -1.75,4.225; 47 -2.25,4.225; 48 -2.75,4.225
SOT23-3 = smd 0.6 x 0.85: 1 -0.95,-1.25; 2 0.95,-1.25; 3 0,1.25
SC70-3 = smd 0.3 x 0.7: 1 -0.65,-1.15; 2 0.65,-1.15; 3 0,1.15
EPSON_FA238V = smd 1.4 x 1.2: 1 -1.1,-0.9; 2 1.1,-0.9; 3 1.1,0.9; 4 -1.1,0.9

### Placement (x,y rotation side)
C1  43.18,36.83 90 bottom
C2  26.67,36.83 90 bottom
C3  22.23,36.83 90 bottom
C4  7.11,31.11 90 bottom
C5  13.97,18.29 270 bottom
C6  11.56,31.5 0 bottom
C7  7.62,33.66 270 bottom
C8  2.03,20.57 90 bottom
C9  7.75,40.77 90 bottom
C10  5.08,17.4 90 top
C11  10.03,17.78 270 top
C12  11.56,34.92 0 bottom
C13  39.37,10.16 270 top
C14  35.81,10.16 270 top
C15  30.48,25.65 0 bottom
C16  43.18,10.16 270 top
C17  46.99,10.16 270 top
C18  35.81,10.16 270 bottom
C19  16.51,4.45 180 bottom
C20  11.68,2.54 90 bottom
C21  39.37,10.16 270 bottom
C22  12.57,9.14 0 bottom
C23  14.48,7.24 270 bottom
C24  14.99,14.61 180 bottom
C25  43.18,10.16 270 bottom
C26  46.99,10.16 270 bottom
C27  9.65,36.83 180 top
C28  30.48,27.43 180 bottom
C29  31.88,11.18 270 top
C30  31.88,8.76 90 top
C31  23.11,11.56 90 bottom
CN3  34.04,45.72 0 top
CN5  19.05,44.45 180 top
D1  47.62,31.75 270 top
D2  47.62,22.86 270 top
D3  26.16,31.75 270 top
D4  26.16,22.86 270 top
D5  14.73,31.75 270 top
D6  14.73,22.86 270 top
D7  16.51,2.54 90 bottom
D8  3.68,24.26 180 bottom
D9  1.02,18.03 270 bottom
D10  11.18,38.4 0 bottom
D12  9.27,21.59 90 top
D13  17.14,34.8 180 bottom
F1  17.27,40.39 180 bottom
IC2  6.35,17.78 90 bottom
IC3  1.52,11.68 270 bottom
IC4  27.05,12.45 180 top
IC5  AS5601-ASOM  [SOIC127P600X175-8N']  25,25 0 bottom
IC6  4.06,37.47 270 bottom
J1  0.64,11.43 270 top
J2  8.64,25.4 270 top
L1  3.68,29.21 270 bottom
LED0  21.08,10.92 180 top
LED1  15.24,3.81 90 top
LED2  13.59,3.81 90 top
LED3  23.24,2.54 90 top
Q1  43.18,31.75 0 top
Q2  43.18,22.86 0 top
Q3  30.48,31.75 0 top
Q4  30.48,22.86 0 top
Q5  19.05,31.75 0 top
Q6  19.05,22.86 0 top
R1  9.02,43.18 90 bottom
R2  9.02,40.77 90 bottom
R3  17.78,27.94 0 bottom
R4  12.83,1.4 0 top
R5  20.83,11.05 180 bottom
R6  16,1.4 180 top
R7  18.41,3.17 0 bottom
R8  7.62,43.18 270 bottom
R12  2.29,18.03 90 bottom
R13  20.95,18.03 90 top
R14  32.38,27.81 90 bottom
R15  32.38,18.03 90 top
R16  45.09,27.81 90 bottom
R17  37.08,17.78 0 top
R18  10.79,10.29 90 bottom
R19  16.26,15.88 0 bottom
R20  12.95,18.29 90 bottom
R21  16.64,12.83 270 bottom
R22  12.95,15.11 90 bottom
R23  12.19,5.08 90 top
R24  18.29,12.45 270 bottom
R25  8.38,31.11 90 bottom
R26  1.78,15.49 270 bottom
R27  7.62,36.2 90 bottom
R28  3.05,22.73 0 bottom
R32  23.11,4.7 180 top
SW1  8.89,3.3 180 top
SW2  19.18,3.81 180 top
U1  13.97,11.94 180 top
U3  13.97,2.54 180 bottom
U4  18.67,17.02 0 top
Y1  7.62,17.78 180 top

### Tracks (layer width: path | path; a pad name or v marks a point on that pad's centre or on a via)
!BRAKE
  Top 0.254: U1.46 15.72,6.87 16.75,5.84 24.52,5.84 27.8,9.12 IC4.30
!CS
  Top 0.254: U1.7 24.59,12.19 IC4.21
!FAULT
  Top 0.254: IC4.17 23.27,14.2 20.97,16.5 17.05,16.5 U1.13
!ISP  (via drill 0.35)
  Top 0.305: U1.5 17.18,11.19 v16.99,11.37 | v17.08,5.17 SW2.A2 SW2.A1
  Bottom 0.305: v16.99,11.37 16.99,11.13 18.44,9.68 18.44,6.66 17.25,5.35 | 17.25,5.35 v17.08,5.17 | R7.1 18.96,3.51 17.25,5.35
!RST  (via drill 0.35)
  Top 0.254: D12.K v9.27,20.42 | SW1.A1 SW1.A2 | v8.51,10.29 8.62,10.19 U1.34 10.52,10.19 10.75,9.95 10.75,4.54 SW1.A1 | R23.1 11.22,4.53 SW1.A1
  Bottom 0.254: v9.27,20.42 9.27,11.43 8.51,10.67 v8.51,10.29
!USB_ACK  (via drill 0.35)
  Top 0.254: v11.92,10.4 12.22,10.7 U1.22 | v7.21,8 6.55,8 5.55,7 3.9,7 2.01,5.11 1.02,5.11 0.66,5.46 0.66,8.25 1.02,8.61 2.07,8.61 v3.43,9.97
  Bottom 0.254: IC3.4 1.95,12.76 1.95,13.2 2.25,13.5 | 2.25,13.5 2.31,13.56 2.31,16.41 2.29,16.43 R12.1 2.15,17.62 v1.84,17.62 | v7.21,8 9.48,10.27 11.79,10.27 v11.92,10.4 | v3.43,9.97 3.63,10.17 3.63,12.53 2.66,13.5 2.25,13.5
+3V3  (via drill 0.35)
  Top 0.254: R23.2 12.69,5.63 v13.72,6.66 | R32.2 22.46,4.7 21.94,4.18 19.16,4.18 v18.11,3.13 | U1.27 10.57,13.69 10.79,13.46 10.79,12.32 | 10.79,12.32 10.66,12.19 U1.30 | v10.95,11.97 10.79,12.13 10.79,12.32 | R12.2 3.64,18.58 v3.81,18.41
  Top 0.305: U1.42 v13.72,6.66 12.39,6.66 12.22,6.83 U1.39 v12.22,8.77 | U1.16 15.22,14.92 C24.2 | R32.2 23.02,5.16 v23.02,5.24
  Bottom 0.203: R24.2 17.91,12.28 R21.2 | R19.2 15.71,14.67 15.54,14.5
  Bottom 0.254: v18.11,3.13 17.91,3.13 | 17.91,3.13 R7.2 | R18.1 11.43,9.74 C22.2 12.06,9.14 12.7,9.78 12.7,10.51 11.23,11.97 v10.95,11.97 | v3.81,18.41 3.95,18.27 3.95,16.24 | D7.A 16.67,3.13 17.91,3.13 | R21.2 16.64,11.94 16.01,11.31
  Bottom 0.305: C23.2 14.39,6.6 13.72,6.6 | D7.A 15.42,3.29 U3.2 | v12.22,8.77 12.02,8.96 C22.2 | v23.02,5.24 26.55,8.76 28.32,8.76 28.32,8.83 28.88,9.4 28.88,12.37 29.84,13.34 29.84,20.94 33.09,24.19 33.09,27.54 32.91,27.72 31.86,27.72 | 31.86,27.72 31.68,27.54 31.68,26.3 C15.1 | 31.86,27.72 31.68,27.72 31.41,27.99 30.48,27.99 | 30.48,27.99 C28.1 | 30.48,27.99 28.78,27.99 | 28.78,27.99 IC5.1 | IC5.2 26.56,25.64 26.29,25.91 26.29,27.56 26.72,27.99 28.78,27.99
  Bottom 0.508: 13.72,4.99 U3.2 | 13.72,4.99 13.72,6.6 v13.72,6.66 | C19.1 15.3,3.79 U3.2 | U3.2 14.92,5.88 17.88,8.84 17.88,9.45 16.01,11.31 15.54,11.79 15.51,11.79 14.48,12.83 14.48,13.44 15.54,14.5 C24.2 | IC2.3 5.18,15.61 5.18,16 4.94,16.24 3.95,16.24 3.71,16 3.71,14.14 4.83,13.03 4.83,8.18 8.02,4.99 13.72,4.99
  other vias: 15.54,14.61 2.29,18.58
+5V
  Bottom 0.152: D9.1 1.54,19.18 3.05,19.18
  Bottom 0.254: U3.3 14.47,1.79 D7.K | CN3.4 38.54,46.59 35.76,49.37 4.15,49.37 0.64,45.85 0.64,26.69 D8.1 3.05,24.24 3.05,22.21
  Bottom 0.508: U3.3 12.38,1.29 C20.1 10.07,1.99 4.17,7.9 4.17,12.75 3.05,13.86 3.05,17.27 3.05,18.54 3.05,19.18 3.05,22.21
CAN_RX  (via drill 0.35)
  Top 0.254: U1.29 8.27,12.69 v8.26,12.7
  Bottom 0.254: v8.26,12.7 6.99,13.97 4.83,13.97 4.45,14.35 IC2.4
CAN_TX  (via drill 0.35)
  Top 0.254: U1.28 8.66,13.19 8.26,13.59 v8.26,13.72
  Bottom 0.254: v8.26,13.72 IC2.1
CANH  (via drill 0.35)
  Top 0.254: v7.11,25.4 J2.2
  Bottom 0.254: IC2.7 6.99,25.27 v7.11,25.4
CANL  (via drill 0.35)
  Top 0.254: v7.11,26.8 7.21,26.9 J2.3
  Bottom 0.254: IC2.6 5.71,25.4 v7.11,26.8
D+  (via drill 0.35)
  Top 0.152: v2.9,10.65 v2.91,10.65 3.68,11.43 4.95,11.43
  Top 0.254: J1.P$3 4.95,11.43 6.35,11.43 8.09,9.69 U1.35
  Bottom 0.152: v2.9,10.65 2.65,10.4 2.65,10.19 2.52,10.05 2.13,10.05 1.92,10.26 IC3.7
D-  (via drill 0.35)
  Top 0.152: v2.8,11.94 v2.8,11.95 2.92,12.06 4.75,12.06 J1.P$2
  Top 0.254: U1.36 7.73,9.19 v6.1,10.82 | J1.P$2 v5.66,12.08
  Bottom 0.152: v2.8,11.94 2.55,11.69 2.55,11.09 2.32,10.86 IC3.6
  Bottom 0.254: v6.1,10.82 6.1,11.65 v5.66,12.08
DIR
  Top 0.254: U1.47 16.22,6.94 16.91,6.25 24.36,6.25 27.3,9.19 IC4.29
GH_A  (via drill 0.35)
  Top 0.254: v31.73,12.7 v31.74,12.69
  Top 0.305: v42.04,18.57 42.04,18.31 42.05,17.78 42.05,17.25 v41.35,16.56 v40.53,16.56 | v31.74,12.69 v32.51,13.45 v33.14,14.09 | IC4.5 v31.73,12.7
  Bottom 0.305: R16.1 45.09,24.38 42.04,21.34 v42.04,18.57 v42.04,17.8 | v41.35,16.56 35.62,16.56 v31.75,12.69 v31.74,12.69
GH_B  (via drill 0.35)
  Top 0.305: v27.42,18.36 v27.42,17.28 v27.42,16.52 27.3,16.41 27.3,15.75 27.3,15.74 IC4.12
  Bottom 0.305: v27.42,16.52 27.42,21.45 28.19,22.23 30.48,22.23 32.38,24.13 R14.1
GH_C  (via drill 0.35)
  Top 0.305: v23.11,18.17 23.73,17.55 25.4,17.55 26.8,16.15 IC4.13
  Bottom 0.305: R3.1 22.8,27.94 24.64,26.1 24.64,21.97 23.11,20.44 v23.11,19.69 v23.11,18.93 v23.11,18.17
GL_A
  Top 0.254: IC4.7 30.71,13.7 30.73,13.72
  Top 0.305: R17.1 34.8,17.78 30.73,13.72
GL_B
  Top 0.305: R15.1 29.86,17.28 28.3,15.73 IC4.10
GL_C
  Top 0.305: R13.1 21.6,16.64 25.02,16.64 25.8,15.86 IC4.15
GND  (via drill 0.35, 2)
  Top 0.254: v8.64,11.68 v8.64,11.69 U1.31 | U1.17 14.72,14.72 v13.97,13.97 13.22,14.72 U1.20 13.22,17.13 10.48,19.88 v10.16,19.88 | C11.2 9.07,17.23 Y1.4 | v14.41,2.46 14.41,3.38 14.72,3.69 15.49,3.69 15.73,3.93 15.76,3.93 15.92,4.09 15.92,5.03 15.88,5.07 v15.88,5.59 | J1.SHIELD3 3.73,7.43 J1.SHIELD4 | 7.68,7.17 v8,7.49 7.56,7.49 7.46,7.39 6.51,7.39 5.72,6.59 4.95,6.59 v4.69,6.33 | 5.76,5.71 5.3,5.71 | IC4.23 25.8,11.2 26.8,12.19 | 26.8,12.19 IC4.33 | IC4.31 28.3,10.69 26.8,12.19
  Top 0.305: U1.11 19.09,14.19 v19.43,13.84 | U1.17 14.72,18.53 v15.24,19.05
  Top 1.016: Q2.3 43.81,20.89 43.8,20.9 44.34,21.44 46.75,21.44 D2.A
  Bottom 0.152: IC3.8 IC3.11 | v1.65,16.76 1.65,16.17 R26.1
  Bottom 0.254: U3.1 13.08,3.79 v14.41,2.46 | v3.05,7.37 3.66,7.37 v4.69,6.33
  other vias: 6.99,14.73 34.29,7.62 43.18,19.05 30.48,19.05 29.21,19.05 30.48,20.32 29.21,20.32 34.29,20.32 24.13,20.32 24.13,19.05 25.4,19.05 25.4,20.32 26.67,20.32 26.67,19.05 26.67,17.78 29.21,17.78 30.48,16.51 19.05,20.32 17.78,20.32 16.51,20.32 16.51,19.05 17.78,19.05 19.05,19.05 19.3,17.65 17.78,17.78 16.51,17.78 15.24,20.32 13.97,20.32 12.95,7.62 30.48,8.89 20.32,15.24 10.67,2.92 8.26,16.38 38.1,20.32 34.54,14.48 24.51,5.08 17.27,3.94 8.13,20.51 6.35,21.97 1.27,1.27 1.27,5.71 6.35,1.27 1.27,24.77 1.27,34.92 1.27,42.55 6.99,48.26 47.62,38.73 47.62,41.91 43.18,41.91 40.64,44.45 27.94,46.99 34.92,1.27 41.91,1.27 48.26,7.62 41.91,7.62 19.68,8.38 22.1,8.38 20.95,6.99 17.53,6.99 27.69,5.08 9.91,7.49 5.84,9.53 1.78,11.56 1.02,19.94 25.15,15.37 1.65,9.65 14.35,9.14 27.05,12.45
  pour Top (isolate 0.305, rank 6, no thermals): -2.03,51.05 52.2,51.05 52.2,-1.52 -2.03,-1.52
  pour Bottom (isolate 0.305, rank 6, no thermals): -3.05,52.2 54.1,52.2 54.1,-2.92 -3.05,-2.92
HALL_U  (via drill 0.35)
  Top 0.254: CN3.3 33.98,42.95 29.09,42.95 23.6,48.44 13.64,48.44 9.31,44.11 9.31,34.88 10.79,33.4 v10.79,22.23 | v13.79,9.98 15.73,9.98 15.75,10.01 16.25,10.01 16.51,9.75 17.4,9.75 17.46,9.69 U1.2 23.27,9.69 23.94,9.02 25.4,9.02 25.8,9.42 IC4.26
  Bottom 0.254: v10.79,22.23 10.79,12.98 v13.79,9.98
HALL_V  (via drill 0.35)
  Top 0.254: CN3.2 31.39,42.55 28.92,42.55 23.43,48.04 13.81,48.04 9.71,43.94 9.71,35.05 11.43,33.33 v11.43,22.86 | v17.14,9.14 17.19,9.19 U1.1 23.19,9.19 23.77,8.61 25.57,8.61 26.3,9.34 IC4.27
  Bottom 0.254: v17.14,9.14 16.61,9.14 16.25,8.79 15.75,8.79 15.39,9.15 15.39,9.24 11.43,13.21 v11.43,22.86
HALL_W  (via drill 0.35)
  Top 0.254: v16,9.4 16.72,8.68 U1.48 25.25,7.71 26.8,9.27 26.8,9.4 IC4.28 | CN3.1 29.49,41.4 23.26,47.63 13.97,47.63 10.12,43.77 10.12,35.22 12.04,33.3 12.04,22.25 v12.06,22.23
  Bottom 0.254: v12.06,22.23 12.06,13.34 v16,9.4
LED0
  Top 0.254: U1.4 20.1,10.69 LED0.A
LED1
  Top 0.254: U1.45 15.22,4.58 LED1.A
LED2
  Top 0.254: U1.44 14.72,5.69 LED2.A
N$1
  Bottom 0.254: IC6.10 4.71,33.39 4.95,33.15 5.97,33.15 | 5.97,33.15 7.58,33.15 C7.2 | IC6.8 6.01,33.19 5.97,33.15
N$2
  Bottom 0.254: R8.2 5.93,42.63 4.71,41.42 IC6.5
N$3
  Bottom 0.254: IC6.4 4.06,41.4 5.82,43.16 8.49,43.16 R1.1 R2.2
N$4
  Bottom 0.254: IC6.6 5.36,41.18 6.1,41.91 7.37,41.91 7.75,41.53 C9.2
N$5  (via drill 0.35)
  Top 0.305: R17.2 v38.48,17.78 v40.01,17.78 v39.24,17.78 | v45.09,20.14 45.09,19.43 | v45.02,19.37 v44.45,18.8
  Bottom 0.305: v44.45,18.8 42.67,17.02 41.79,17.02 41.03,17.78 v38.48,17.78 | v45.09,20.14 45.09,19.44 v45.02,19.37
N$6  (via drill 0.35)
  Top 0.305: Q1.4 v45.09,29.65
  Bottom 0.305: v45.09,29.65 R16.2
  other vias: 45.09,28.56
N$7
  Top 0.305: Q4.4 R15.2
N$8
  Top 0.254: LED2.K 13.59,1.61 R4.2
N$9  (via drill 0.35)
  Top 0.254: LED0.K 21.5,10.92 R5.2
  other vias: 21.38,11.05
N$10
  Top 0.254: LED1.K 15.24,1.48 R6.2
N$11  (via drill 0.35)
  Top 0.305: Q3.4 32.38,29.59 v32.4,29.6
  Bottom 0.305: v32.4,29.6 32.4,28.58 R14.2
  other vias: 32.38,28.56
N$12
  Top 0.305: R13.2 Q6.4
N$13  (via drill 0.35)
  Top 0.305: Q5.4 v20.95,29.53
  Bottom 0.305: R3.2 17.03,29.22 17.34,29.53 v20.95,29.53
  other vias: 17.03,27.94
N$14  (via drill 0.35)
  Top 0.305: J1.P$1 4.73,12.7 1.78,12.7 0.94,11.87 v0.94,10.63
  Bottom 0.254: IC3.9 v0.94,10.63 IC3.10
N$15  (via drill 0.35)
  Top 0.254: U1.24 11.22,12.56 11.56,12.22 11.56,11.66 10.95,11.05 v10.95,11.03
  Bottom 0.254: v10.95,11.03 10.79,10.87 R18.2
N$16
  Bottom 0.254: L1.1 6.37,31.31 C4.1
  pour Bottom (no thermals): 2.67,35.43 2.41,35.18 1.52,34.29 1.52,30.86 1.78,30.61 5.46,30.61 5.84,30.61 6.1,30.86 6.1,32.38 4.45,32.38 3.81,33.02 3.81,35.31 3.68,35.43
N$17
  Bottom 0.254: IC6.9 5.36,35.34 5.71,35.69 5.73,35.69 6.86,35.69 | R25.2 8.38,33.24 7.99,33.63 7.29,33.63 6.86,34.07 6.86,35.69 | R27.1 7.58,35.69 6.86,35.69
N$18
  Bottom 0.254: IC6.11 4.06,33.27 4.83,32.51 6.22,32.51 6.26,32.51 C4.2
N$19
  Bottom 0.406: R28.2 2.03,22.27 C8.2
N$21
  Top 0.254: C11.1 9.68,18.68 Y1.1 8.72,18.46 9.42,17.76 10.4,17.76 10.56,17.6 10.56,16.86 9.74,16.05 U1.25
N$22
  Top 0.254: U1.26 8.97,14.19 6.52,16.64 6.52,16.76 | 6.52,16.76 Y1.3 | C10.1 6.43,16.85 6.52,16.76
N$23
  Bottom 2: D13.2 15.65,38.3 F1.1 15.76,40.39 D13.1 D13.2
N$24
  Top 0.254: J2.1 9.27,23.27 D12.A
N$26
  Bottom 0.254: R25.1 8.38,28.83 7.11,27.56 4.13,27.56 L1.2
  Bottom 0.406: D8.2 3.98,23.11 R28.1
  pour Bottom (no thermals): 1.4,29.46 1.4,25.4 2.92,23.88 4.45,23.88 6.6,26.04 6.6,29.84 1.27,29.84 1.27,29.59
N$28
  Bottom 0.152: IC3.3 1.52,13.59 1.78,13.84 R26.2
N$31
  Top 0.254: R32.1 23.66,3.71 LED3.A
N$32  (via drill 0.35)
  Top 0.254: IC4.24 23.43,10.7 C31.1
  other vias: 23.11,11.01
N$48
  Top 0.254: C30.1 29.89,8.21 28.8,9.3 IC4.32
N$55
  Top 0.254: IC4.2 30.71,11.2 31.28,10.63 C29.2
N$56
  Top 0.254: IC4.1 30.58,10.7 31.88,9.4 C30.2
PWM_AH
  Top 0.254: IC4.25 23.53,10 23.34,10.19 U1.3
PWM_EN
  Top 0.254: IC4.22 24.59,11.69 U1.6
QEI_A  (via drill 0.35)
  Top 0.254: v13.84,21.97 13.34,21.46 13.34,18.4 14.22,17.51 U1.18
  Bottom 0.254: IC5.8 18.78,26.91 v13.84,21.97
QEI_B  (via drill 0.35)
  Top 0.254: U1.19 13.72,17.44 12.93,18.23 12.93,21.91 14.11,23.09 v16.03,23.09
  Bottom 0.254: IC5.5 16.38,23.09 16.18,23.09 v16.03,23.09
SCL  (via drill 0.35)
  Top 0.203: U1.37 11.22,9.19 11.85,9.81 12.16,9.81 15.21,12.87 v15.21,13.13
  Bottom 0.2: 21.98,21.34 23.3,22.66
  Bottom 0.203: IC5.7 21.7,25.64 21.08,25.02 21.08,24.15 21.48,23.75 23.08,23.75 23.3,23.52 23.3,22.66 23.16,22.52 | v15.21,13.13 15.21,13.31 15.75,13.84 16,13.84 16.81,14.65 R19.1 16.81,17.25 17.09,17.54 17.09,20.45 17.97,21.34 21.98,21.34
SCLK
  Top 0.254: U1.8 24.59,12.69 IC4.20
SDA  (via drill 0.35)
  Top 0.203: U1.38 11.72,8.44 11.64,8.53 11.64,9.01 12.09,9.46 12.31,9.46 15.37,12.53 v15.82,12.53
  Bottom 0.203: v15.82,12.53 16.02,12.53 16.28,12.78 16.97,12.78 18.29,14.1 | IC5.6 23.26,24.36 23.75,23.88 23.75,22.61 22.1,20.95 18.8,20.95 18.36,20.52 18.36,14.17 18.29,14.1 | R24.1 18.29,14.1
SDI
  Top 0.254: IC4.19 24.59,13.19 U1.9
SDO
  Top 0.254: U1.12 19.48,14.69 20.48,13.68 24.59,13.68 IC4.18
SH_A  (via drill 0.35)
  Top 0.254: 31.23,13.2 31.24,13.21
  Top 0.305: 35.18,17.15 v35.31,17.15 | v34.16,16.13 31.24,13.21 | v34.16,16.13 35.18,17.15 | v34.17,16.13 v34.16,16.13 | v34.74,16.7 v34.74,16.71 35.18,17.15 | 31.24,13.21 | IC4.6 31.23,13.2
  Top 0.61: v43.18,23.4 Q2.MB
  Bottom 0.305: v35.31,17.15 36.93,17.15 v43.18,23.4 | v35.31,17.15 35.18,17.15 | v35.31,17.15 35.19,17.15 v34.74,16.7 v34.17,16.13
  other vias: 42.55,22.82 41.97,22.25
  pour Top (isolate 0.305, rank 2, no thermals): 36.45,39.88 36.45,21.59 49.53,21.59 49.53,30.99 40.64,30.99 40.64,39.88
SH_B
  Top 0.305: 27.92,22.08 27.92,19.43 28.05,19.3 28.05,16.26 27.8,16.01 IC4.11
  pour Top (isolate 0.305, no thermals): 33.02,39.88 33.02,30.99 24.77,30.99 24.77,21.59 36.45,21.59 36.45,39.88
SH_C
  Top 0.305: Q6.MB 21.72,21.97 21.72,17.78 22.4,17.09 25.21,17.09 26.3,16 IC4.14
  pour Top (isolate 0.305, rank 3, no thermals): 31.11,40.01 31.11,36.83 24.77,36.83 24.77,21.59 12.7,21.59 12.7,30.99 21.46,30.99 21.46,40.01
SHDN  (via drill 0.35)
  Top 0.254: v4.45,19.92 4.81,19.56 9.54,19.56 10.24,18.86 10.4,18.86 11.72,17.54 U1.23
  Bottom 0.254: v4.45,19.92 IC2.5
V+  (via drill 0.45)
  Bottom 0.305: C6.1 12.95,30.12 R20.2
  other vias: 18.29,35.56 19.3,35.56 20.32,35.56 20.32,34.54 19.3,34.54 18.29,34.54 19.3,31.5 20.32,31.5 19.3,32.51 19.3,33.53 20.32,33.53 20.32,32.51 29.72,35.56 30.73,35.56 31.75,35.56 31.75,34.54 30.73,34.54 29.72,34.54 29.72,33.53 29.72,32.51 30.73,32.51 30.73,33.53 31.75,33.53 31.75,32.51 41.4,35.56 42.42,35.56 42.42,32.51 43.43,35.56 42.42,34.54 41.4,34.54 41.4,33.53 42.42,33.53 43.43,34.54 42.42,31.5 41.4,31.5 41.4,32.51 46.74,13.97 47.75,13.97 47.75,16 46.74,16 46.74,16.89 47.75,16.89 46.74,12.95 47.75,12.95 45.72,16.89 45.72,16 45.72,13.97 45.72,12.95 45.72,17.78 46.74,17.78 47.75,17.78 45.72,14.99 46.74,14.99 47.75,14.99 17.27,31.5 18.29,31.5 18.29,32.51 18.29,33.53 28.7,32.51 28.7,33.53 28.7,34.54 28.7,35.56 44.45,35.56 43.43,31.5 43.43,32.51 43.43,33.53 47.75,11.94 47.75,10.92 46.74,11.94 46.74,10.92 45.72,11.94 45.72,10.92 44.58,14.61 44.58,13.59 44.58,12.57 44.58,11.56 44.58,15.62 43.56,14.61 43.56,13.59 43.56,12.57 43.56,11.56 43.56,15.62 42.55,15.62 42.55,11.56 42.55,12.57 42.55,13.59 42.55,14.61 41.53,14.61 41.53,13.59 41.53,12.57 41.53,11.56 41.53,15.62 40.51,15.62 40.51,11.56 40.51,12.57 40.51,13.59 40.51,14.61 39.5,14.61 39.5,13.59 39.5,12.57 39.5,11.56 39.5,15.62 38.48,15.62 38.48,12.57 38.48,13.59 38.48,14.61 17.27,32.51 17.27,33.53 17.27,34.54 17.27,35.56 16.26,35.56 16.26,34.54 16.26,33.53 16.26,32.51 15.24,35.56 15.24,34.54 15.24,33.53 15.24,32.51 14.22,32.51 14.22,33.53 14.22,34.54 14.22,35.56 14.22,36.58 13.21,36.58 13.21,37.59 13.21,35.56 13.21,34.54 13.21,33.53 13.21,32.51 31.75,31.5 30.73,31.5 29.72,31.5 28.7,31.5 27.69,35.56 27.69,34.54 27.69,33.53 27.69,32.51 26.67,32.51 26.67,33.53 26.67,34.54 26.67,35.56 25.65,35.56 25.65,34.54 25.65,33.53 25.65,32.51 42.42,36.58 43.43,36.58 44.45,36.58 44.45,34.54 44.45,33.53 44.45,32.51 44.45,31.5 45.47,35.56 45.47,32.51 46.48,35.56 45.47,34.54 45.47,33.53 46.48,34.54 47.5,35.56 46.48,32.51 46.48,33.53 45.47,36.58 46.48,36.58 47.5,36.58 47.5,34.54 47.5,33.53 47.5,32.51
  pour Bottom (isolate 0.305, no thermals): 12.57,39.26 12.7,30.48 49.53,30.48 49.53,36.83 19.05,36.83 18.92,39.26
  pour Top (isolate 0.305, rank 4, no thermals): 10.67,38.23 10.67,30.48 49.53,30.48 49.53,36.83 19.05,36.83 19.05,38.23
  pour Bottom (isolate 0.305, rank 4, no thermals): 49.4,36.07 49.4,10.92 45.72,10.92 45.72,36.07
  pour Top (rank 4, no thermals): 49.53,17.78 49.53,11.18 28.96,11.18 28.96,12.7 31.88,12.7 31.88,13.97 36.32,13.97 36.32,18.29 49.53,18.29
  pour Bottom (isolate 0.305, rank 4, no thermals): 49.53,11.05 35.31,11.05 35.31,16 49.53,16
VBAT  (via drill 0.35)
  Top 0.305: v15.72,17.22 U1.15
  Bottom 0.305: 12.95,17.4 R22.2 | 12.95,17.4 R20.1 | v15.72,17.22 15.2,17.74 C5.2 13.29,17.74 12.95,17.4
VBAT/2
  Bottom 0.254: R8.1 7.62,44.45 | R1.2 9.02,44.45
  Bottom 0.406: CN5.P 9.02,44.45 7.62,44.45 5.84,44.45 3.41,42.02 IC6.3
  Bottom 2: F1.2 16.05,43.23 CN5.P
VBUS
  Bottom 0.254: IC3.2 1.12,13.99 1.02,14.1 0.72,13.8 IC3.1
  Bottom 0.305: D9.2 1.02,14.1
VREF  (via drill 0.35)
  Top 0.254: v16.99,13.97 17.02,13.97
  Top 0.305: U1.14 16.22,15.28 16.38,15.11 17.02,15.11 | U1.10 17.3,13.69 17.02,13.97 17.02,15.11 | U4.1 17.77,15.87 17.02,15.11
  Bottom 0.254: R21.1 16.99,13.73 v16.99,13.97